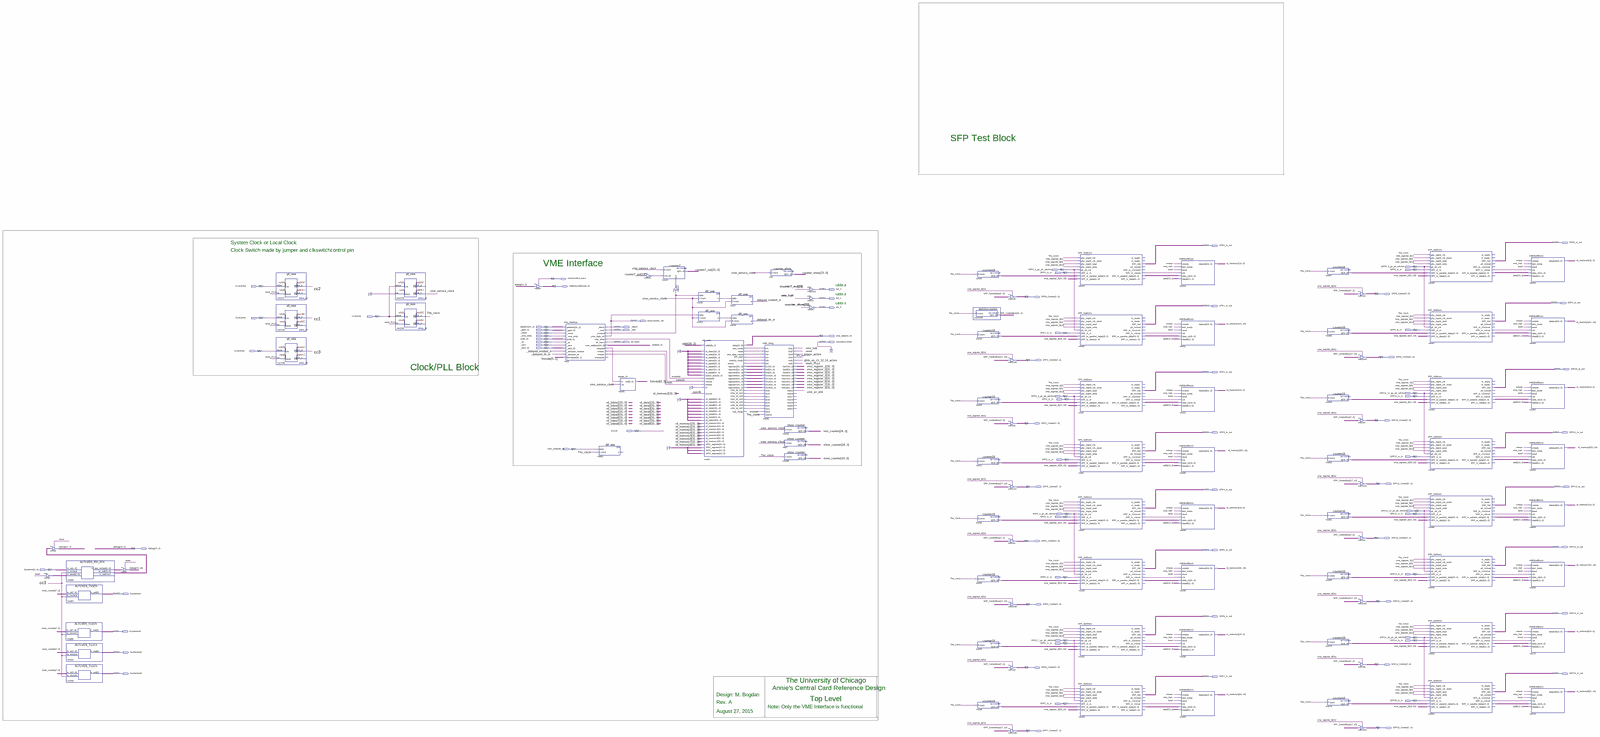
[diagram p0: schematic sheet, whole]
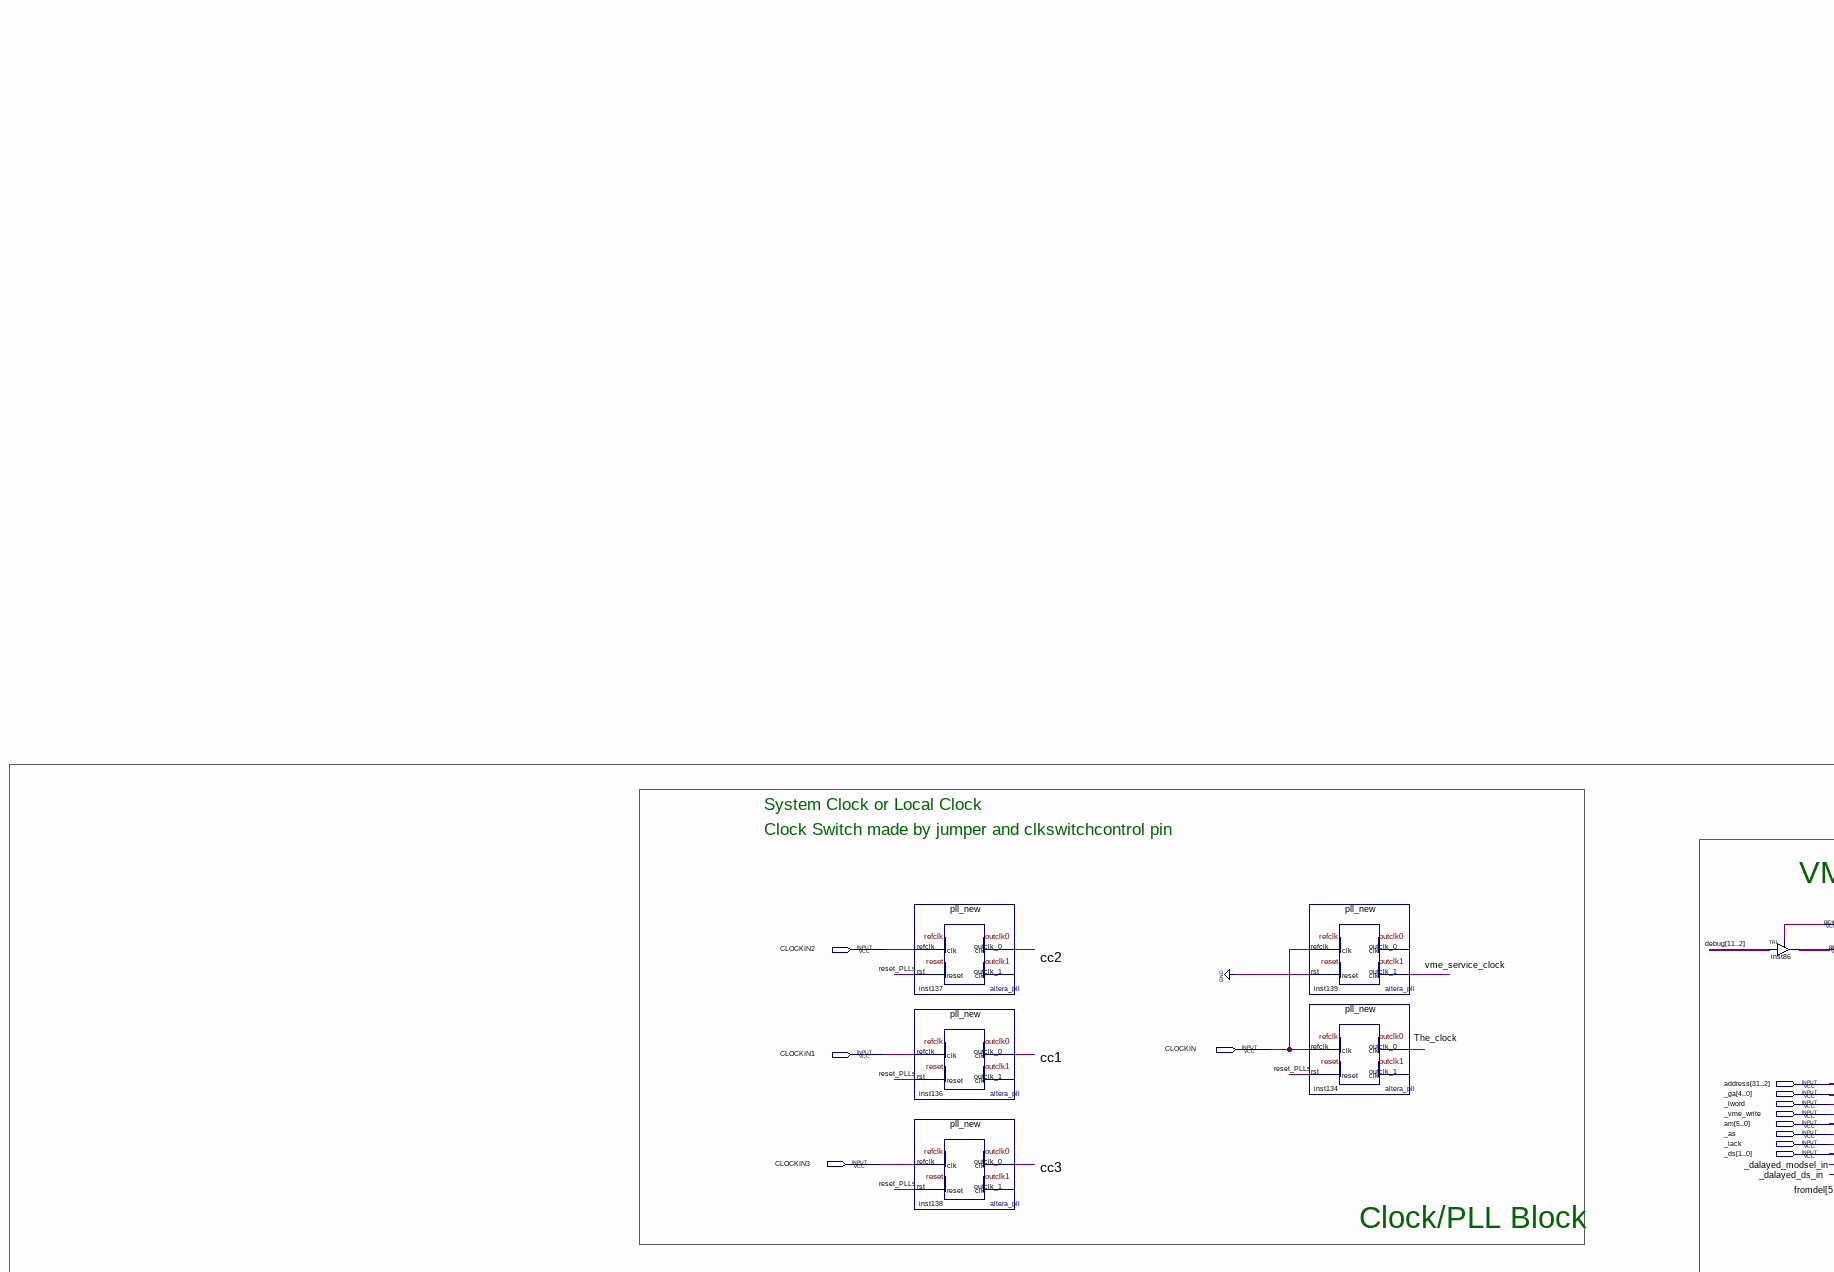
[diagram p1: schematic sheet, upper left part]
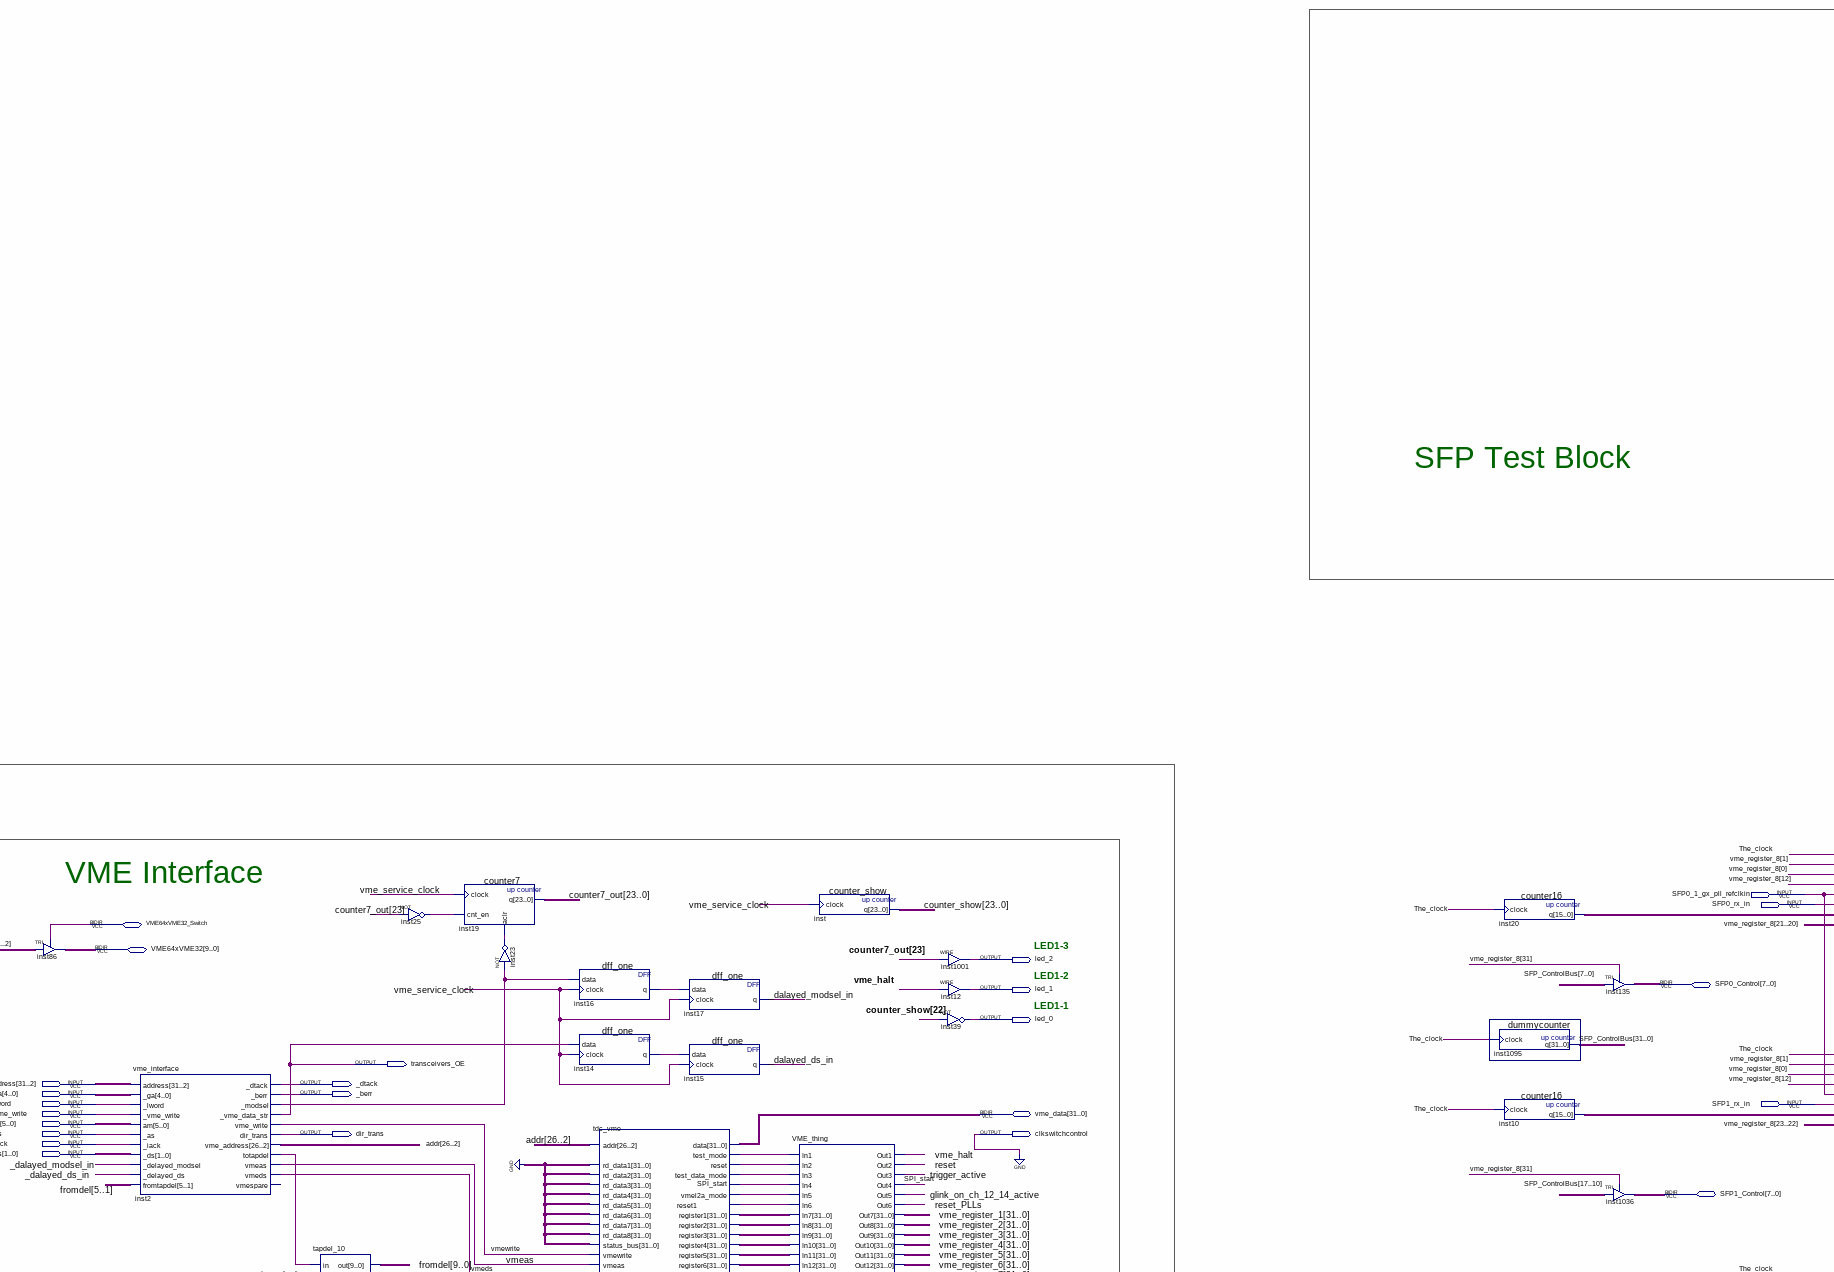
[diagram p2: schematic sheet, upper centre part]
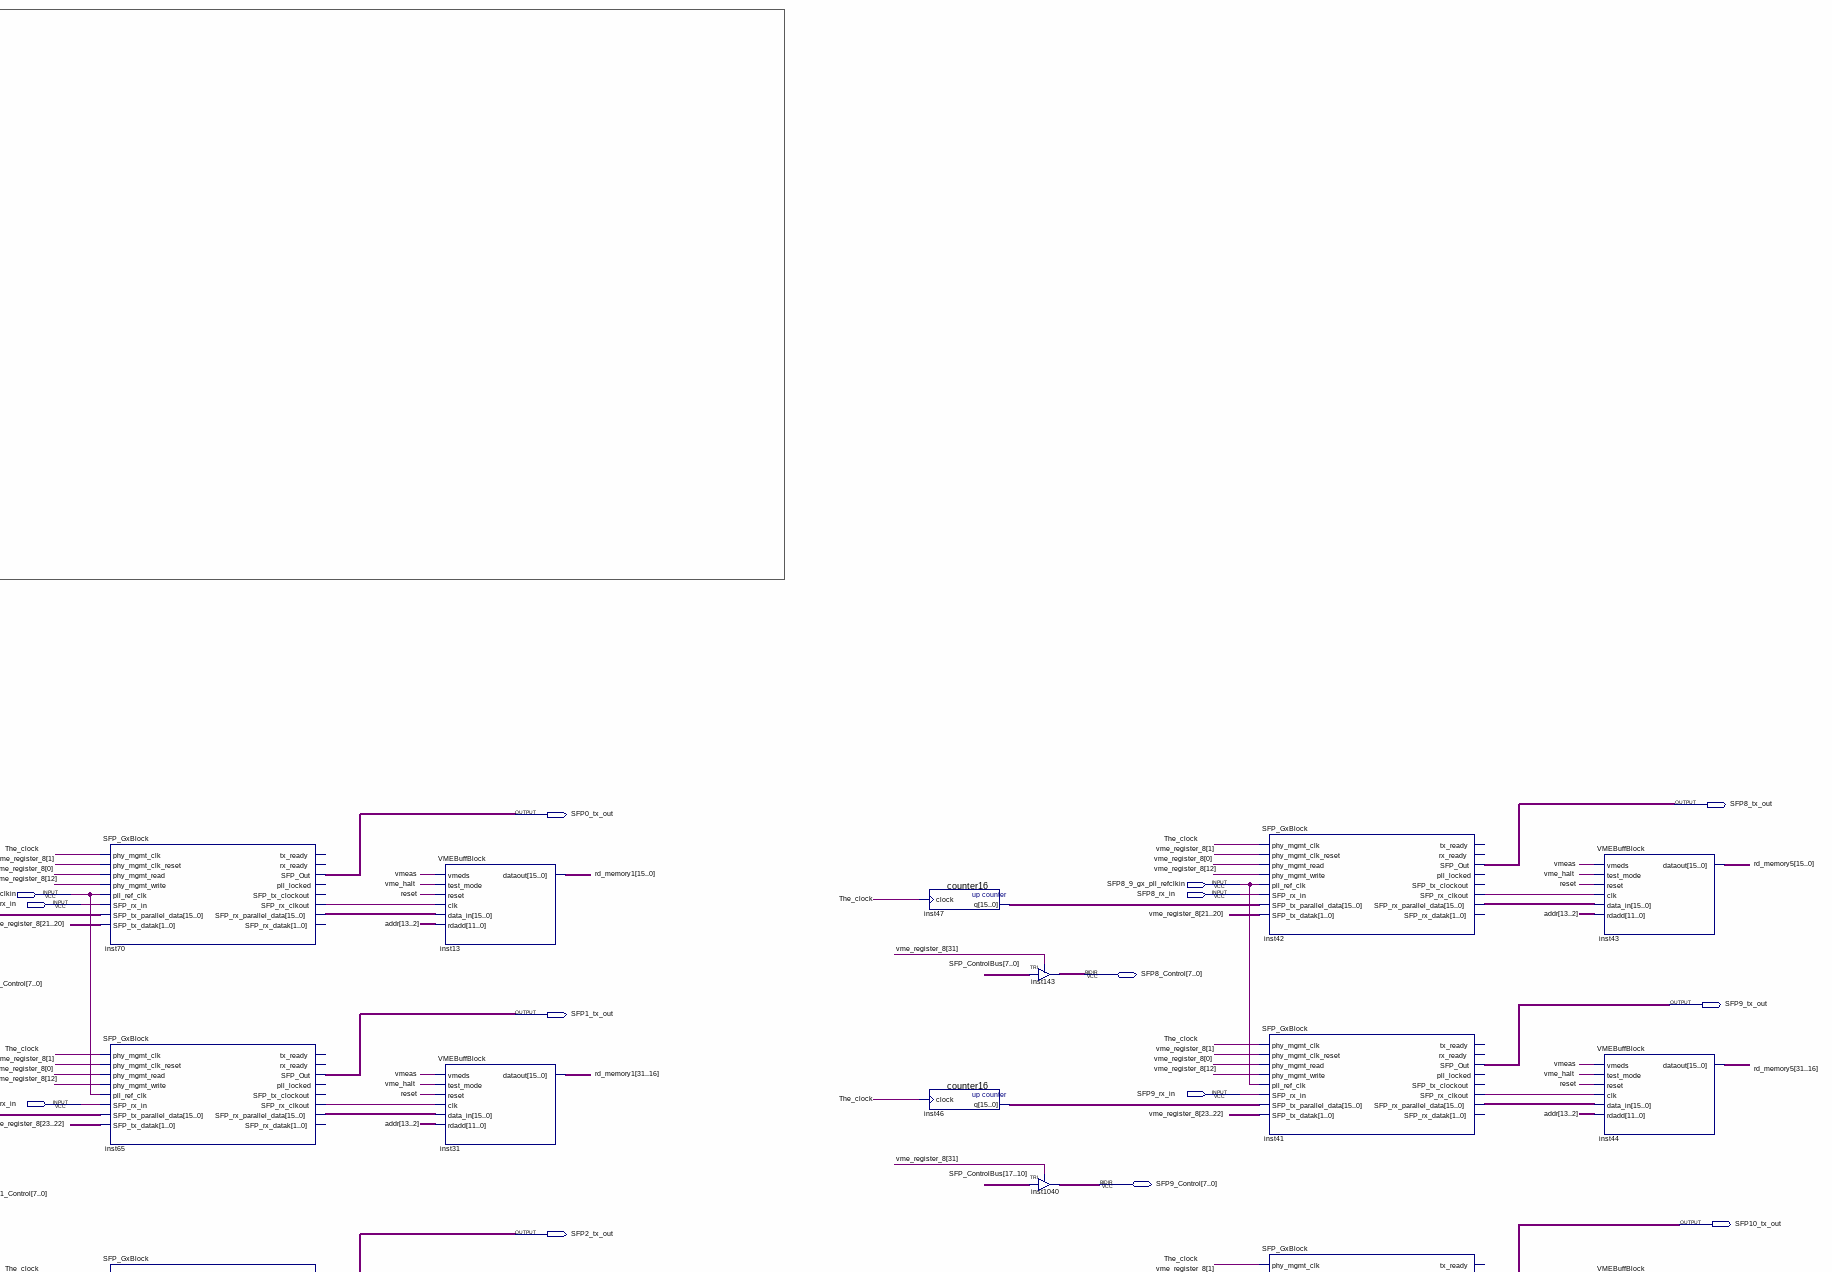
[diagram p3: schematic sheet, upper right part]
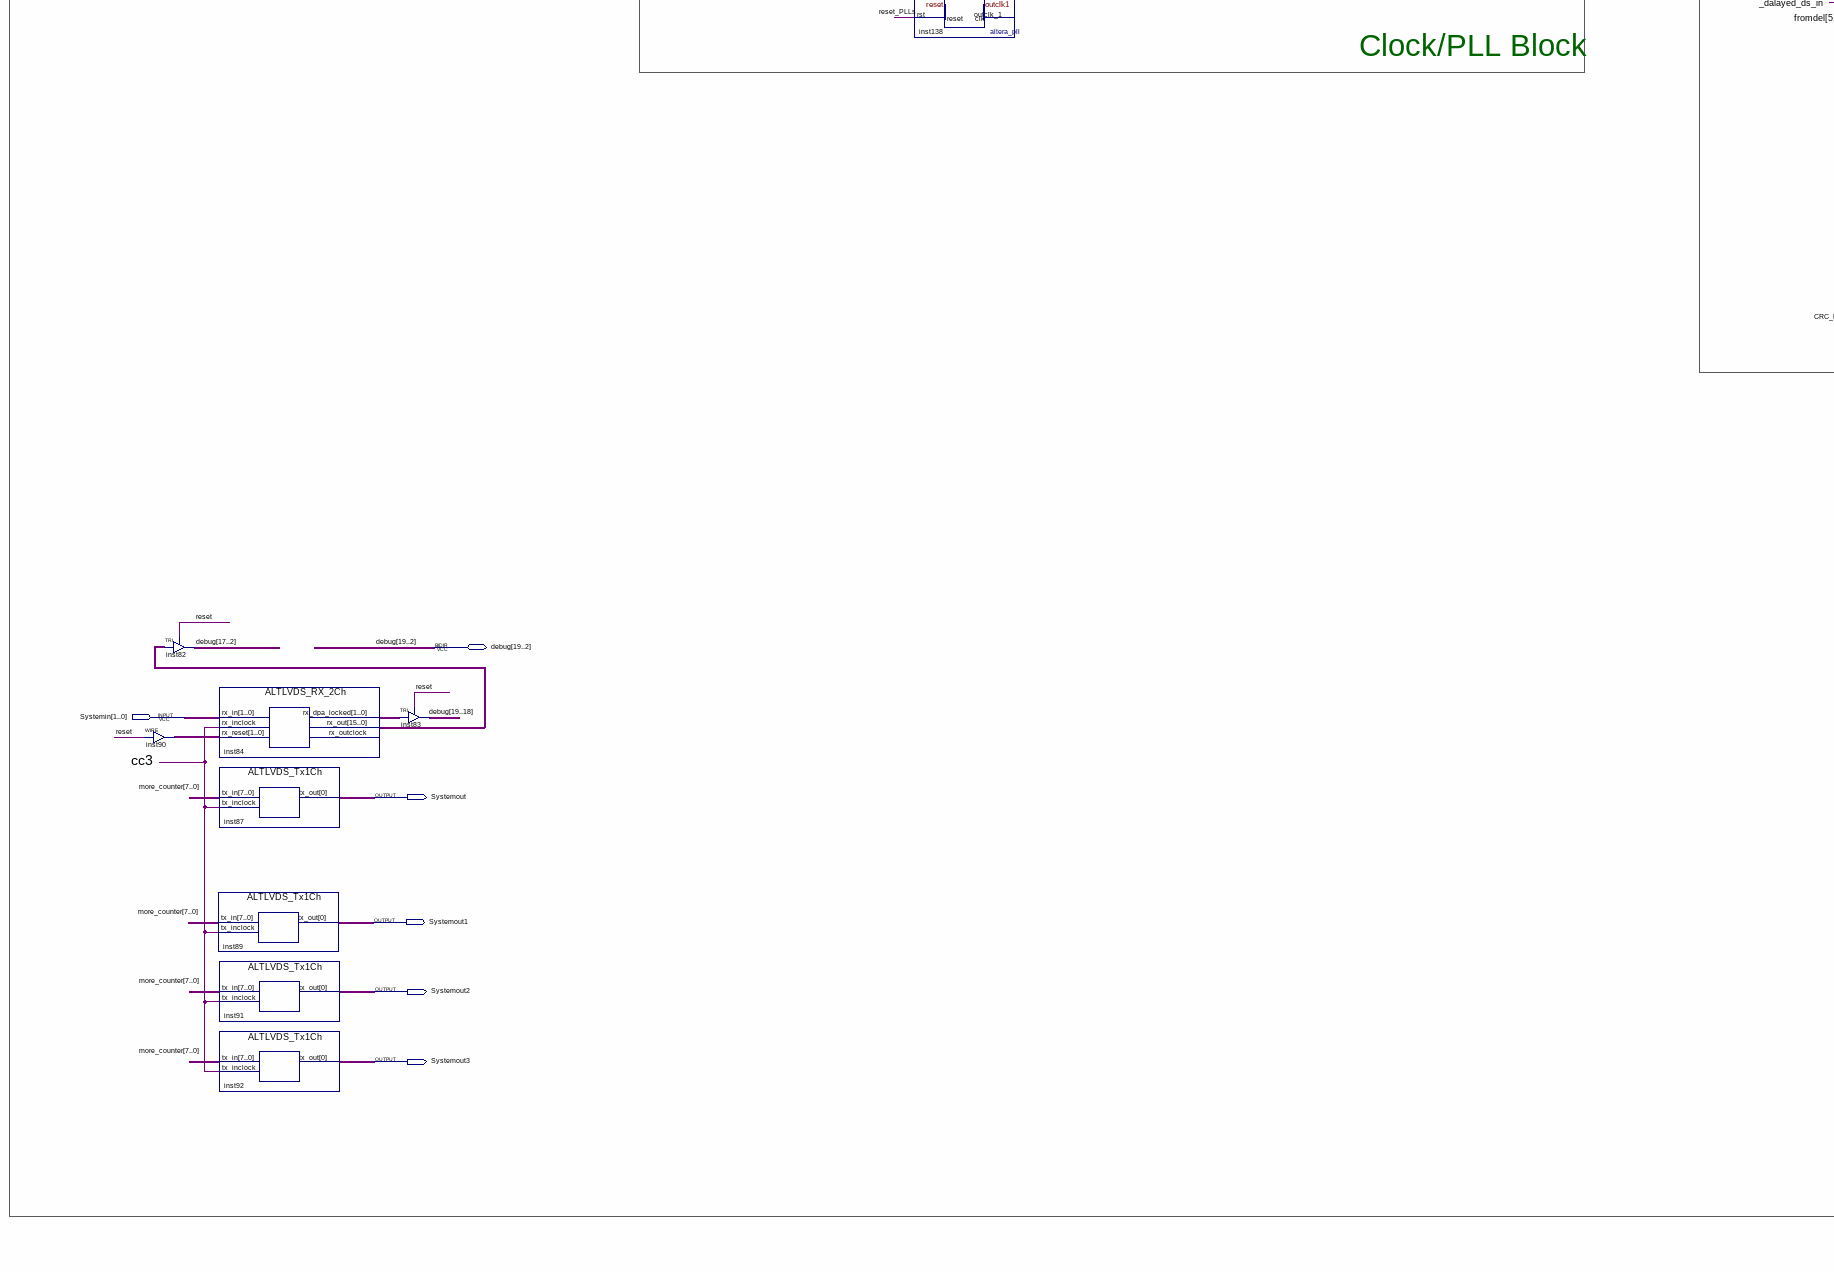
[diagram p4: schematic sheet, lower left part]
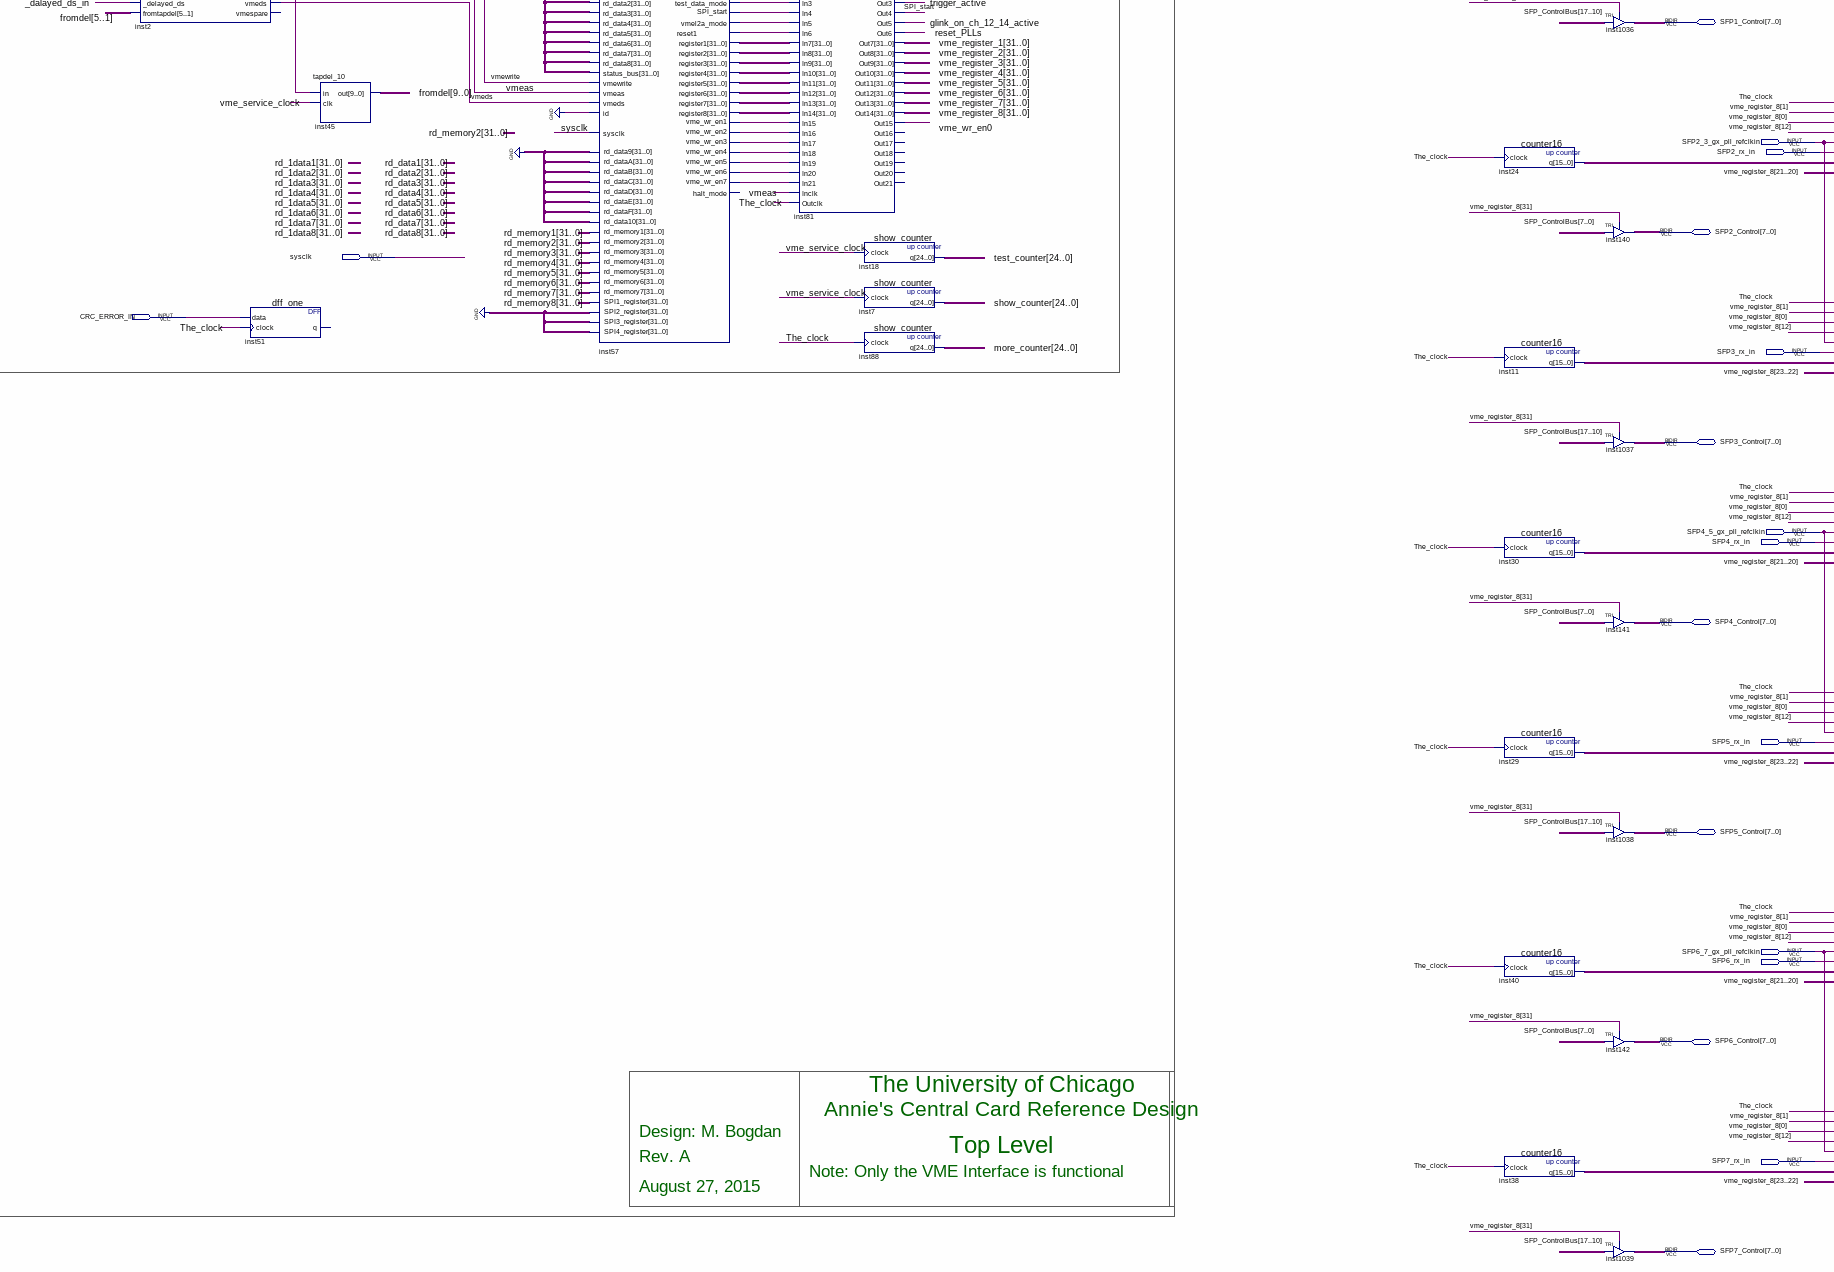
[diagram p5: schematic sheet, lower centre part]
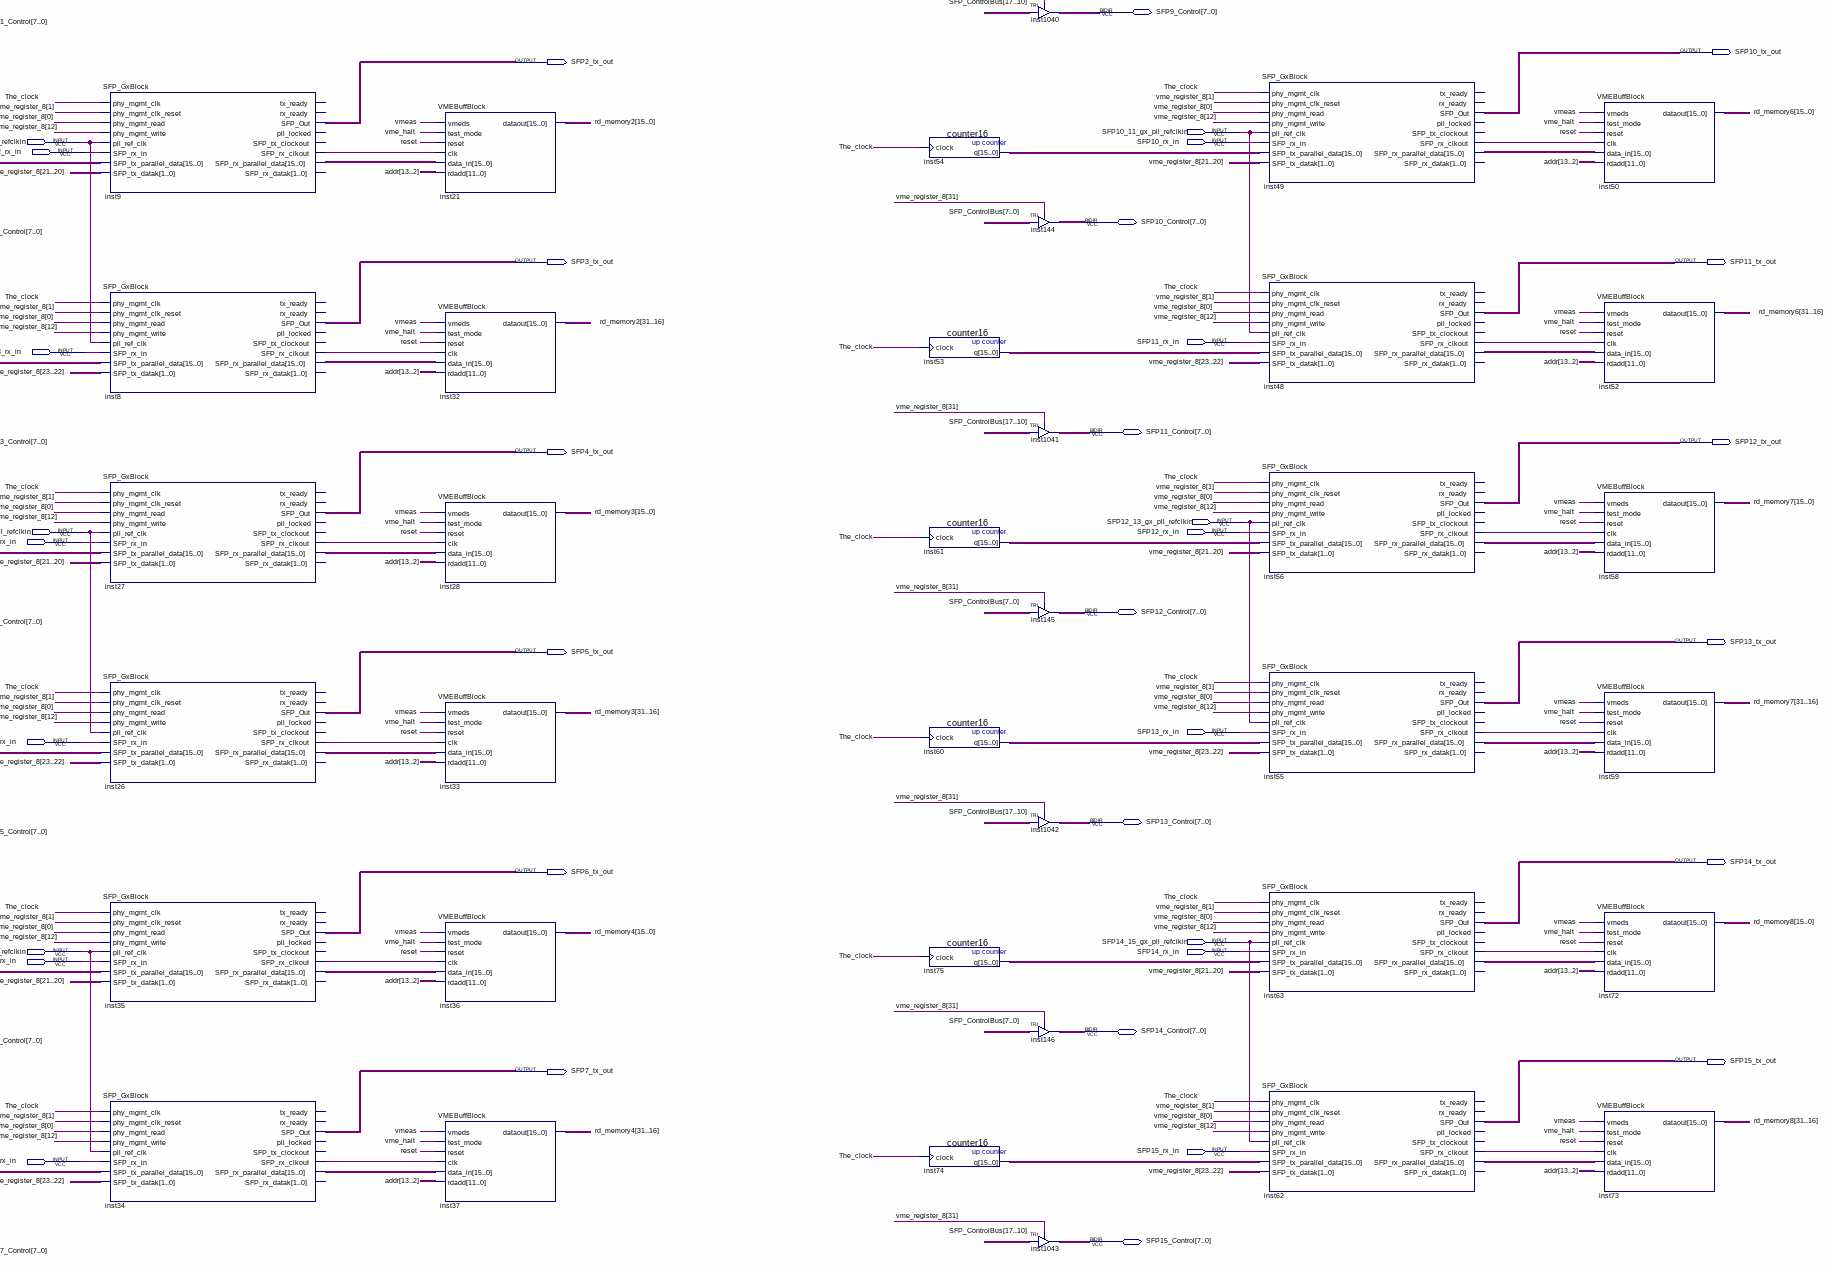
[diagram p6: schematic sheet, lower right part]
// Quartus schematic Rx_NoFit.bdf as structural Verilog: 98 symbols, 87 pins
module Rx_NoFit (
  input  SFP8_9_gx_pll_refclkin,
  input  SFP0_1_gx_pll_refclkin,
  input  SFP8_rx_in,
  input  SFP0_rx_in,
  input  CLOCKIN2,
  input  CLOCKIN,
  input  CLOCKIN1,
  input  [31:2] address,
  input  [4:0] _ga,
  input  SFP9_rx_in,
  input  _lword,
  input  SFP1_rx_in,
  input  _vme_write,
  input  [5:0] am,
  input  _as,
  input  _iack,
  input  [1:0] _ds,
  input  CLOCKIN3,
  input  SFP10_11_gx_pll_refclkin,
  input  SFP2_3_gx_pll_refclkin,
  input  SFP10_rx_in,
  input  SFP2_rx_in,
  input  sysclk,
  input  CRC_ERROR_IN,
  input  SFP11_rx_in,
  input  SFP3_rx_in,
  input  SFP12_13_gx_pll_refclkin,
  input  SFP4_5_gx_pll_refclkin,
  input  SFP12_rx_in,
  input  SFP4_rx_in,
  input  [1:0] Systemin,
  input  SFP13_rx_in,
  input  SFP5_rx_in,
  input  SFP14_15_gx_pll_refclkin,
  input  SFP6_7_gx_pll_refclkin,
  input  SFP14_rx_in,
  input  SFP6_rx_in,
  input  SFP15_rx_in,
  input  SFP7_rx_in,
  inout  VME64xVME32_Switch,
  inout  [9:0] VME64xVME32,
  inout  [7:0] SFP8_Control,
  inout  [7:0] SFP0_Control,
  inout  [31:0] vme_data,
  inout  [7:0] SFP9_Control,
  inout  [7:0] SFP1_Control,
  inout  [7:0] SFP10_Control,
  inout  [7:0] SFP2_Control,
  inout  [7:0] SFP11_Control,
  inout  [7:0] SFP3_Control,
  inout  [7:0] SFP12_Control,
  inout  [7:0] SFP4_Control,
  inout  [19:2] debug,
  inout  [7:0] SFP13_Control,
  inout  [7:0] SFP5_Control,
  inout  [7:0] SFP14_Control,
  inout  [7:0] SFP6_Control,
  inout  [7:0] SFP15_Control,
  inout  [7:0] SFP7_Control,
  output SFP8_tx_out,
  output SFP0_tx_out,
  output led_2,
  output led_1,
  output SFP9_tx_out,
  output SFP1_tx_out,
  output led_0,
  output transceivers_OE,
  output _dtack,
  output _berr,
  output dir_trans,
  output clkswitchcontrol,
  output SFP10_tx_out,
  output SFP2_tx_out,
  output SFP3_tx_out,
  output SFP11_tx_out,
  output SFP12_tx_out,
  output SFP4_tx_out,
  output SFP13_tx_out,
  output SFP5_tx_out,
  output Systemout,
  output SFP14_tx_out,
  output SFP6_tx_out,
  output Systemout1,
  output Systemout2,
  output Systemout3,
  output SFP15_tx_out,
  output SFP7_tx_out
);

  wire _dalayed_ds_in, _dalayed_modsel_in, cc1, cc2, cc3, glink_on_ch_12_14_active, inst2__modsel,
       inst2_totapdel, inst8_sfp_rx_clkout, inst9_sfp_rx_clkout, inst14_q, inst16_q, inst23_out, inst25_out,
       inst26_sfp_rx_clkout, inst27_sfp_rx_clkout, inst34_sfp_rx_clkout, inst35_sfp_rx_clkout,
       inst41_sfp_rx_clkout, inst42_sfp_rx_clkout, inst48_sfp_rx_clkout, inst49_sfp_rx_clkout,
       inst55_sfp_rx_clkout, inst56_sfp_rx_clkout, inst57_reset, inst57_reset1, inst57_spi_start,
       inst57_test_data_mode, inst57_test_mode, inst57_vme_wr_en1, inst57_vme_wr_en2, inst57_vme_wr_en3,
       inst57_vme_wr_en4, inst57_vme_wr_en5, inst57_vme_wr_en6, inst57_vme_wr_en7, inst57_vmel2a_mode,
       inst62_sfp_rx_clkout, inst63_sfp_rx_clkout, inst65_sfp_rx_clkout, inst70_sfp_rx_clkout, reset,
       reset_PLLs, SPI_start, The_clock, trigger_active, vme_halt, vme_service_clock, vme_wr_en0, vmeas,
       vmeds, vmewrite;
  wire [1:0] inst84_rx_dpa_locked, inst90_out;
  wire [9:0] fromdel;
  wire [15:0] inst8_sfp_rx_parallel_data, inst9_sfp_rx_parallel_data, inst10_q, inst11_q, inst20_q, inst24_q,
       inst26_sfp_rx_parallel_data, inst27_sfp_rx_parallel_data, inst29_q, inst30_q,
       inst34_sfp_rx_parallel_data, inst35_sfp_rx_parallel_data, inst38_q, inst40_q,
       inst41_sfp_rx_parallel_data, inst42_sfp_rx_parallel_data, inst46_q, inst47_q,
       inst48_sfp_rx_parallel_data, inst49_sfp_rx_parallel_data, inst53_q, inst54_q,
       inst55_sfp_rx_parallel_data, inst56_sfp_rx_parallel_data, inst60_q, inst61_q,
       inst62_sfp_rx_parallel_data, inst63_sfp_rx_parallel_data, inst65_sfp_rx_parallel_data,
       inst70_sfp_rx_parallel_data, inst74_q, inst75_q, inst84_rx_out;
  wire [23:0] counter7_out, counter_show;
  wire [24:0] more_counter, show_counter, test_counter;
  wire [26:2] addr;
  wire [31:0] inst57_register1, inst57_register2, inst57_register3, inst57_register4, inst57_register5,
       inst57_register6, inst57_register7, inst57_register8, rd_memory1, rd_memory2, rd_memory3, rd_memory4,
       rd_memory5, rd_memory6, rd_memory7, rd_memory8, SFP_ControlBus, vme_register_1, vme_register_2,
       vme_register_3, vme_register_4, vme_register_5, vme_register_6, vme_register_7, vme_register_8;

  TRI inst82[15:0] (.IN(inst84_rx_out), .OE(reset), .OUT(debug[17:2]));
  assign inst90_out = {2{reset}};  // WIRE inst90
  ALTLVDS_RX_2Ch inst84 (
    .rx_in(Systemin), .rx_inclock(cc3), .rx_reset(inst90_out), .rx_dpa_locked(inst84_rx_dpa_locked),
    .rx_out(inst84_rx_out));  // open: rx_outclock
  ALTLVDS_Tx1Ch inst87 (.tx_in(more_counter[7:0]), .tx_inclock(cc3), .tx_out(Systemout));
  ALTLVDS_Tx1Ch inst89 (.tx_in(more_counter[7:0]), .tx_inclock(cc3), .tx_out(Systemout1));
  ALTLVDS_Tx1Ch inst91 (.tx_in(more_counter[7:0]), .tx_inclock(cc3), .tx_out(Systemout2));
  ALTLVDS_Tx1Ch inst92 (.tx_in(more_counter[7:0]), .tx_inclock(cc3), .tx_out(Systemout3));
  TRI inst83[1:0] (.IN(inst84_rx_dpa_locked), .OE(reset), .OUT(debug[19:18]));
  pll_new inst137 (.refclk(CLOCKIN2), .rst(reset_PLLs), .outclk_0(cc2));  // open: outclk_1
  pll_new inst136 (.refclk(CLOCKIN1), .rst(reset_PLLs), .outclk_0(cc1));  // open: outclk_1
  pll_new inst138 (.refclk(CLOCKIN3), .rst(reset_PLLs), .outclk_0(cc3));  // open: outclk_1
  pll_new inst139 (.refclk(CLOCKIN), .rst(1'b0), .outclk_1(vme_service_clock));  // open: outclk_0
  pll_new inst134 (.refclk(CLOCKIN), .rst(reset_PLLs), .outclk_0(The_clock));  // open: outclk_1
  TRI inst86[9:0] (.IN(debug[11:2]), .OE(VME64xVME32_Switch), .OUT(VME64xVME32));
  vme_interface inst2 (
    .address(address), ._ga(_ga), ._lword(_lword), ._vme_write(_vme_write), .am(am), ._as(_as),
    ._iack(_iack), ._ds(_ds), ._delayed_modsel(_dalayed_modsel_in), ._delayed_ds(_dalayed_ds_in),
    .fromtapdel(fromdel[5:1]), ._modsel(inst2__modsel), ._vme_data_str(transceivers_OE),
    .vme_write(vmewrite), .dir_trans(dir_trans), .vme_address(addr), .totapdel(inst2_totapdel),
    .vmeas(vmeas), .vmeds(vmeds), ._dtack(_dtack), ._berr(_berr));  // open: vmespare
  dff_one inst51 (.data(CRC_ERROR_IN), .clock(The_clock));  // open: q
  tapdel_10 inst45 (.in(inst2_totapdel), .clk(vme_service_clock), .out(fromdel));
  not inst25 (inst25_out, counter7_out[23]);
  counter7 inst19 (.clock(vme_service_clock), .cnt_en(inst25_out), .aclr(inst23_out), .q(counter7_out));
  not inst23 (inst23_out, inst2__modsel);
  dff_one inst16 (.data(inst2__modsel), .clock(vme_service_clock), .q(inst16_q));
  dff_one inst14 (.data(transceivers_OE), .clock(vme_service_clock), .q(inst14_q));
  tdc_vme inst57 (
    .addr(addr), .rd_data1({32{1'b0}}), .rd_data2({32{1'b0}}), .rd_data3({32{1'b0}}), .rd_data4({32{1'b0}}),
    .rd_data5({32{1'b0}}), .rd_data6({32{1'b0}}), .rd_data7({32{1'b0}}), .rd_data8({32{1'b0}}),
    .status_bus({32{1'b0}}), .vmewrite(vmewrite), .vmeas(vmeas), .vmeds(vmeds), .id(1'b0), .sysclk(sysclk),
    .rd_dataA({32{1'b0}}), .rd_dataB({32{1'b0}}), .rd_dataC({32{1'b0}}), .rd_dataD({32{1'b0}}),
    .rd_dataF({32{1'b0}}), .rd_data10({32{1'b0}}), .rd_data9({32{1'b0}}), .rd_dataE({32{1'b0}}),
    .rd_memory1(rd_memory1), .rd_memory2(rd_memory2), .rd_memory3(rd_memory3), .rd_memory4(rd_memory4),
    .rd_memory5(rd_memory5), .rd_memory6(rd_memory6), .rd_memory7(rd_memory7), .SPI1_register(rd_memory8),
    .SPI2_register({32{1'b0}}), .SPI3_register({32{1'b0}}), .SPI4_register({32{1'b0}}),
    .test_mode(inst57_test_mode), .reset(inst57_reset), .test_data_mode(inst57_test_data_mode),
    .vmel2a_mode(inst57_vmel2a_mode), .register1(inst57_register1), .register2(inst57_register2),
    .register3(inst57_register3), .register4(inst57_register4), .register5(inst57_register5),
    .register6(inst57_register6), .register7(inst57_register7), .register8(inst57_register8),
    .reset1(inst57_reset1), .vme_wr_en1(inst57_vme_wr_en1), .vme_wr_en2(inst57_vme_wr_en2),
    .vme_wr_en3(inst57_vme_wr_en3), .vme_wr_en4(inst57_vme_wr_en4), .vme_wr_en5(inst57_vme_wr_en5),
    .vme_wr_en6(inst57_vme_wr_en6), .vme_wr_en7(inst57_vme_wr_en7), .SPI_start(inst57_spi_start),
    .data(vme_data));  // open: halt_mode
  dff_one inst17 (.data(inst16_q), .clock(vme_service_clock), .q(_dalayed_modsel_in));
  dff_one inst15 (.data(inst14_q), .clock(vme_service_clock), .q(_dalayed_ds_in));
  VME_thing inst81 (
    .In1(inst57_test_mode), .In2(inst57_reset), .In3(inst57_test_data_mode), .In4(inst57_spi_start),
    .In5(inst57_vmel2a_mode), .In6(inst57_reset1), .In7(inst57_register1), .In8(inst57_register2),
    .In9(inst57_register3), .In10(inst57_register4), .In11(inst57_register5), .In12(inst57_register6),
    .In13(inst57_register7), .In14(inst57_register8), .In15(inst57_vme_wr_en1), .In16(inst57_vme_wr_en2),
    .In17(inst57_vme_wr_en3), .In18(inst57_vme_wr_en4), .In19(inst57_vme_wr_en5), .In20(inst57_vme_wr_en6),
    .In21(inst57_vme_wr_en7), .Inclk(vmeas), .Outclk(The_clock), .Out1(vme_halt), .Out2(reset),
    .Out3(trigger_active), .Out4(SPI_start), .Out5(glink_on_ch_12_14_active), .Out6(reset_PLLs),
    .Out7(vme_register_1), .Out8(vme_register_2), .Out9(vme_register_3), .Out10(vme_register_4),
    .Out11(vme_register_5), .Out12(vme_register_6), .Out13(vme_register_7), .Out14(vme_register_8),
    .Out15(vme_wr_en0));  // open: Out16, Out17, Out18, Out19, Out20, Out21
  counter_show inst (.clock(vme_service_clock), .q(counter_show));
  show_counter inst18 (.clock(vme_service_clock), .q(test_counter));
  show_counter inst7 (.clock(vme_service_clock), .q(show_counter));
  show_counter inst88 (.clock(The_clock), .q(more_counter));
  assign led_2 = counter7_out[23];  // WIRE inst1001
  assign led_1 = vme_halt;  // WIRE inst12
  not inst39 (led_0, counter_show[22]);
  counter16 inst20 (.clock(The_clock), .q(inst20_q));
  dummycounter inst1095 (.clock(The_clock), .q(SFP_ControlBus));
  counter16 inst10 (.clock(The_clock), .q(inst10_q));
  counter16 inst24 (.clock(The_clock), .q(inst24_q));
  counter16 inst11 (.clock(The_clock), .q(inst11_q));
  counter16 inst30 (.clock(The_clock), .q(inst30_q));
  counter16 inst29 (.clock(The_clock), .q(inst29_q));
  counter16 inst40 (.clock(The_clock), .q(inst40_q));
  counter16 inst38 (.clock(The_clock), .q(inst38_q));
  TRI inst135[7:0] (.IN(SFP_ControlBus[7:0]), .OE(vme_register_8[31]), .OUT(SFP0_Control));
  TRI inst1036[7:0] (.IN(SFP_ControlBus[17:10]), .OE(vme_register_8[31]), .OUT(SFP1_Control));
  TRI inst140[7:0] (.IN(SFP_ControlBus[7:0]), .OE(vme_register_8[31]), .OUT(SFP2_Control));
  TRI inst1037[7:0] (.IN(SFP_ControlBus[17:10]), .OE(vme_register_8[31]), .OUT(SFP3_Control));
  TRI inst141[7:0] (.IN(SFP_ControlBus[7:0]), .OE(vme_register_8[31]), .OUT(SFP4_Control));
  TRI inst1038[7:0] (.IN(SFP_ControlBus[17:10]), .OE(vme_register_8[31]), .OUT(SFP5_Control));
  TRI inst142[7:0] (.IN(SFP_ControlBus[7:0]), .OE(vme_register_8[31]), .OUT(SFP6_Control));
  TRI inst1039[7:0] (.IN(SFP_ControlBus[17:10]), .OE(vme_register_8[31]), .OUT(SFP7_Control));
  SFP_GxBlock inst70 (
    .phy_mgmt_clk(The_clock), .phy_mgmt_clk_reset(vme_register_8[1]), .phy_mgmt_read(vme_register_8[0]),
    .phy_mgmt_write(vme_register_8[12]), .pll_ref_clk(SFP0_1_gx_pll_refclkin), .SFP_rx_in(SFP0_rx_in),
    .SFP_tx_parallel_data(inst20_q), .SFP_tx_datak(vme_register_8[21:20]), .SFP_Out(SFP0_tx_out),
    .SFP_rx_clkout(inst70_sfp_rx_clkout), .SFP_rx_parallel_data(inst70_sfp_rx_parallel_data));  // open: tx_ready, rx_ready, pll_locked, SFP_tx_clockout, SFP_rx_datak
  SFP_GxBlock inst65 (
    .phy_mgmt_clk(The_clock), .phy_mgmt_clk_reset(vme_register_8[1]), .phy_mgmt_read(vme_register_8[0]),
    .phy_mgmt_write(vme_register_8[12]), .pll_ref_clk(SFP0_1_gx_pll_refclkin), .SFP_rx_in(SFP1_rx_in),
    .SFP_tx_parallel_data(inst10_q), .SFP_tx_datak(vme_register_8[23:22]), .SFP_Out(SFP1_tx_out),
    .SFP_rx_clkout(inst65_sfp_rx_clkout), .SFP_rx_parallel_data(inst65_sfp_rx_parallel_data));  // open: tx_ready, rx_ready, pll_locked, SFP_tx_clockout, SFP_rx_datak
  SFP_GxBlock inst9 (
    .phy_mgmt_clk(The_clock), .phy_mgmt_clk_reset(vme_register_8[1]), .phy_mgmt_read(vme_register_8[0]),
    .phy_mgmt_write(vme_register_8[12]), .pll_ref_clk(SFP2_3_gx_pll_refclkin), .SFP_rx_in(SFP2_rx_in),
    .SFP_tx_parallel_data(inst24_q), .SFP_tx_datak(vme_register_8[21:20]), .SFP_Out(SFP2_tx_out),
    .SFP_rx_clkout(inst9_sfp_rx_clkout), .SFP_rx_parallel_data(inst9_sfp_rx_parallel_data));  // open: tx_ready, rx_ready, pll_locked, SFP_tx_clockout, SFP_rx_datak
  SFP_GxBlock inst8 (
    .phy_mgmt_clk(The_clock), .phy_mgmt_clk_reset(vme_register_8[1]), .phy_mgmt_read(vme_register_8[0]),
    .phy_mgmt_write(vme_register_8[12]), .pll_ref_clk(SFP2_3_gx_pll_refclkin), .SFP_rx_in(SFP3_rx_in),
    .SFP_tx_parallel_data(inst11_q), .SFP_tx_datak(vme_register_8[23:22]), .SFP_Out(SFP3_tx_out),
    .SFP_rx_clkout(inst8_sfp_rx_clkout), .SFP_rx_parallel_data(inst8_sfp_rx_parallel_data));  // open: tx_ready, rx_ready, pll_locked, SFP_tx_clockout, SFP_rx_datak
  SFP_GxBlock inst27 (
    .phy_mgmt_clk(The_clock), .phy_mgmt_clk_reset(vme_register_8[1]), .phy_mgmt_read(vme_register_8[0]),
    .phy_mgmt_write(vme_register_8[12]), .pll_ref_clk(SFP4_5_gx_pll_refclkin), .SFP_rx_in(SFP4_rx_in),
    .SFP_tx_parallel_data(inst30_q), .SFP_tx_datak(vme_register_8[21:20]), .SFP_Out(SFP4_tx_out),
    .SFP_rx_clkout(inst27_sfp_rx_clkout), .SFP_rx_parallel_data(inst27_sfp_rx_parallel_data));  // open: tx_ready, rx_ready, pll_locked, SFP_tx_clockout, SFP_rx_datak
  SFP_GxBlock inst26 (
    .phy_mgmt_clk(The_clock), .phy_mgmt_clk_reset(vme_register_8[1]), .phy_mgmt_read(vme_register_8[0]),
    .phy_mgmt_write(vme_register_8[12]), .pll_ref_clk(SFP4_5_gx_pll_refclkin), .SFP_rx_in(SFP5_rx_in),
    .SFP_tx_parallel_data(inst29_q), .SFP_tx_datak(vme_register_8[23:22]), .SFP_Out(SFP5_tx_out),
    .SFP_rx_clkout(inst26_sfp_rx_clkout), .SFP_rx_parallel_data(inst26_sfp_rx_parallel_data));  // open: tx_ready, rx_ready, pll_locked, SFP_tx_clockout, SFP_rx_datak
  SFP_GxBlock inst35 (
    .phy_mgmt_clk(The_clock), .phy_mgmt_clk_reset(vme_register_8[1]), .phy_mgmt_read(vme_register_8[0]),
    .phy_mgmt_write(vme_register_8[12]), .pll_ref_clk(SFP6_7_gx_pll_refclkin), .SFP_rx_in(SFP6_rx_in),
    .SFP_tx_parallel_data(inst40_q), .SFP_tx_datak(vme_register_8[21:20]), .SFP_Out(SFP6_tx_out),
    .SFP_rx_clkout(inst35_sfp_rx_clkout), .SFP_rx_parallel_data(inst35_sfp_rx_parallel_data));  // open: tx_ready, rx_ready, pll_locked, SFP_tx_clockout, SFP_rx_datak
  SFP_GxBlock inst34 (
    .phy_mgmt_clk(The_clock), .phy_mgmt_clk_reset(vme_register_8[1]), .phy_mgmt_read(vme_register_8[0]),
    .phy_mgmt_write(vme_register_8[12]), .pll_ref_clk(SFP6_7_gx_pll_refclkin), .SFP_rx_in(SFP7_rx_in),
    .SFP_tx_parallel_data(inst38_q), .SFP_tx_datak(vme_register_8[23:22]), .SFP_Out(SFP7_tx_out),
    .SFP_rx_clkout(inst34_sfp_rx_clkout), .SFP_rx_parallel_data(inst34_sfp_rx_parallel_data));  // open: tx_ready, rx_ready, pll_locked, SFP_tx_clockout, SFP_rx_datak
  VMEBuffBlock inst13 (
    .vmeds(vmeas), .test_mode(vme_halt), .reset(reset), .clk(inst70_sfp_rx_clkout), .rdadd(addr[13:2]),
    .data_in(inst70_sfp_rx_parallel_data), .dataout(rd_memory1[15:0]));
  VMEBuffBlock inst31 (
    .vmeds(vmeas), .test_mode(vme_halt), .reset(reset), .clk(inst65_sfp_rx_clkout), .rdadd(addr[13:2]),
    .data_in(inst65_sfp_rx_parallel_data), .dataout(rd_memory1[31:16]));
  VMEBuffBlock inst21 (
    .vmeds(vmeas), .test_mode(vme_halt), .reset(reset), .clk(inst9_sfp_rx_clkout), .rdadd(addr[13:2]),
    .data_in(inst9_sfp_rx_parallel_data), .dataout(rd_memory2[15:0]));
  VMEBuffBlock inst32 (
    .vmeds(vmeas), .test_mode(vme_halt), .reset(reset), .clk(inst8_sfp_rx_clkout), .rdadd(addr[13:2]),
    .data_in(inst8_sfp_rx_parallel_data), .dataout(rd_memory2[31:16]));
  VMEBuffBlock inst28 (
    .vmeds(vmeas), .test_mode(vme_halt), .reset(reset), .clk(inst27_sfp_rx_clkout), .rdadd(addr[13:2]),
    .data_in(inst27_sfp_rx_parallel_data), .dataout(rd_memory3[15:0]));
  VMEBuffBlock inst33 (
    .vmeds(vmeas), .test_mode(vme_halt), .reset(reset), .clk(inst26_sfp_rx_clkout), .rdadd(addr[13:2]),
    .data_in(inst26_sfp_rx_parallel_data), .dataout(rd_memory3[31:16]));
  VMEBuffBlock inst36 (
    .vmeds(vmeas), .test_mode(vme_halt), .reset(reset), .clk(inst35_sfp_rx_clkout), .rdadd(addr[13:2]),
    .data_in(inst35_sfp_rx_parallel_data), .dataout(rd_memory4[15:0]));
  VMEBuffBlock inst37 (
    .vmeds(vmeas), .test_mode(vme_halt), .reset(reset), .clk(inst34_sfp_rx_clkout), .rdadd(addr[13:2]),
    .data_in(inst34_sfp_rx_parallel_data), .dataout(rd_memory4[31:16]));
  counter16 inst47 (.clock(The_clock), .q(inst47_q));
  counter16 inst46 (.clock(The_clock), .q(inst46_q));
  counter16 inst54 (.clock(The_clock), .q(inst54_q));
  counter16 inst53 (.clock(The_clock), .q(inst53_q));
  counter16 inst61 (.clock(The_clock), .q(inst61_q));
  counter16 inst60 (.clock(The_clock), .q(inst60_q));
  counter16 inst75 (.clock(The_clock), .q(inst75_q));
  counter16 inst74 (.clock(The_clock), .q(inst74_q));
  TRI inst143[7:0] (.IN(SFP_ControlBus[7:0]), .OE(vme_register_8[31]), .OUT(SFP8_Control));
  TRI inst1040[7:0] (.IN(SFP_ControlBus[17:10]), .OE(vme_register_8[31]), .OUT(SFP9_Control));
  TRI inst144[7:0] (.IN(SFP_ControlBus[7:0]), .OE(vme_register_8[31]), .OUT(SFP10_Control));
  TRI inst1041[7:0] (.IN(SFP_ControlBus[17:10]), .OE(vme_register_8[31]), .OUT(SFP11_Control));
  TRI inst145[7:0] (.IN(SFP_ControlBus[7:0]), .OE(vme_register_8[31]), .OUT(SFP12_Control));
  TRI inst1042[7:0] (.IN(SFP_ControlBus[17:10]), .OE(vme_register_8[31]), .OUT(SFP13_Control));
  TRI inst146[7:0] (.IN(SFP_ControlBus[7:0]), .OE(vme_register_8[31]), .OUT(SFP14_Control));
  TRI inst1043[7:0] (.IN(SFP_ControlBus[17:10]), .OE(vme_register_8[31]), .OUT(SFP15_Control));
  SFP_GxBlock inst42 (
    .phy_mgmt_clk(The_clock), .phy_mgmt_clk_reset(vme_register_8[1]), .phy_mgmt_read(vme_register_8[0]),
    .phy_mgmt_write(vme_register_8[12]), .pll_ref_clk(SFP8_9_gx_pll_refclkin), .SFP_rx_in(SFP8_rx_in),
    .SFP_tx_parallel_data(inst47_q), .SFP_tx_datak(vme_register_8[21:20]), .SFP_Out(SFP8_tx_out),
    .SFP_rx_clkout(inst42_sfp_rx_clkout), .SFP_rx_parallel_data(inst42_sfp_rx_parallel_data));  // open: tx_ready, rx_ready, pll_locked, SFP_tx_clockout, SFP_rx_datak
  SFP_GxBlock inst41 (
    .phy_mgmt_clk(The_clock), .phy_mgmt_clk_reset(vme_register_8[1]), .phy_mgmt_read(vme_register_8[0]),
    .phy_mgmt_write(vme_register_8[12]), .pll_ref_clk(SFP8_9_gx_pll_refclkin), .SFP_rx_in(SFP9_rx_in),
    .SFP_tx_parallel_data(inst46_q), .SFP_tx_datak(vme_register_8[23:22]), .SFP_Out(SFP9_tx_out),
    .SFP_rx_clkout(inst41_sfp_rx_clkout), .SFP_rx_parallel_data(inst41_sfp_rx_parallel_data));  // open: tx_ready, rx_ready, pll_locked, SFP_tx_clockout, SFP_rx_datak
  SFP_GxBlock inst49 (
    .phy_mgmt_clk(The_clock), .phy_mgmt_clk_reset(vme_register_8[1]), .phy_mgmt_read(vme_register_8[0]),
    .phy_mgmt_write(vme_register_8[12]), .pll_ref_clk(SFP10_11_gx_pll_refclkin), .SFP_rx_in(SFP10_rx_in),
    .SFP_tx_parallel_data(inst54_q), .SFP_tx_datak(vme_register_8[21:20]), .SFP_Out(SFP10_tx_out),
    .SFP_rx_clkout(inst49_sfp_rx_clkout), .SFP_rx_parallel_data(inst49_sfp_rx_parallel_data));  // open: tx_ready, rx_ready, pll_locked, SFP_tx_clockout, SFP_rx_datak
  SFP_GxBlock inst48 (
    .phy_mgmt_clk(The_clock), .phy_mgmt_clk_reset(vme_register_8[1]), .phy_mgmt_read(vme_register_8[0]),
    .phy_mgmt_write(vme_register_8[12]), .pll_ref_clk(SFP10_11_gx_pll_refclkin), .SFP_rx_in(SFP11_rx_in),
    .SFP_tx_parallel_data(inst53_q), .SFP_tx_datak(vme_register_8[23:22]), .SFP_Out(SFP11_tx_out),
    .SFP_rx_clkout(inst48_sfp_rx_clkout), .SFP_rx_parallel_data(inst48_sfp_rx_parallel_data));  // open: tx_ready, rx_ready, pll_locked, SFP_tx_clockout, SFP_rx_datak
  SFP_GxBlock inst56 (
    .phy_mgmt_clk(The_clock), .phy_mgmt_clk_reset(vme_register_8[1]), .phy_mgmt_read(vme_register_8[0]),
    .phy_mgmt_write(vme_register_8[12]), .pll_ref_clk(SFP12_13_gx_pll_refclkin), .SFP_rx_in(SFP12_rx_in),
    .SFP_tx_parallel_data(inst61_q), .SFP_tx_datak(vme_register_8[21:20]), .SFP_Out(SFP12_tx_out),
    .SFP_rx_clkout(inst56_sfp_rx_clkout), .SFP_rx_parallel_data(inst56_sfp_rx_parallel_data));  // open: tx_ready, rx_ready, pll_locked, SFP_tx_clockout, SFP_rx_datak
  SFP_GxBlock inst55 (
    .phy_mgmt_clk(The_clock), .phy_mgmt_clk_reset(vme_register_8[1]), .phy_mgmt_read(vme_register_8[0]),
    .phy_mgmt_write(vme_register_8[12]), .pll_ref_clk(SFP12_13_gx_pll_refclkin), .SFP_rx_in(SFP13_rx_in),
    .SFP_tx_parallel_data(inst60_q), .SFP_tx_datak(vme_register_8[23:22]), .SFP_Out(SFP13_tx_out),
    .SFP_rx_clkout(inst55_sfp_rx_clkout), .SFP_rx_parallel_data(inst55_sfp_rx_parallel_data));  // open: tx_ready, rx_ready, pll_locked, SFP_tx_clockout, SFP_rx_datak
  SFP_GxBlock inst63 (
    .phy_mgmt_clk(The_clock), .phy_mgmt_clk_reset(vme_register_8[1]), .phy_mgmt_read(vme_register_8[0]),
    .phy_mgmt_write(vme_register_8[12]), .pll_ref_clk(SFP14_15_gx_pll_refclkin), .SFP_rx_in(SFP14_rx_in),
    .SFP_tx_parallel_data(inst75_q), .SFP_tx_datak(vme_register_8[21:20]), .SFP_Out(SFP14_tx_out),
    .SFP_rx_clkout(inst63_sfp_rx_clkout), .SFP_rx_parallel_data(inst63_sfp_rx_parallel_data));  // open: tx_ready, rx_ready, pll_locked, SFP_tx_clockout, SFP_rx_datak
  SFP_GxBlock inst62 (
    .phy_mgmt_clk(The_clock), .phy_mgmt_clk_reset(vme_register_8[1]), .phy_mgmt_read(vme_register_8[0]),
    .phy_mgmt_write(vme_register_8[12]), .pll_ref_clk(SFP14_15_gx_pll_refclkin), .SFP_rx_in(SFP15_rx_in),
    .SFP_tx_parallel_data(inst74_q), .SFP_tx_datak(vme_register_8[23:22]), .SFP_Out(SFP15_tx_out),
    .SFP_rx_clkout(inst62_sfp_rx_clkout), .SFP_rx_parallel_data(inst62_sfp_rx_parallel_data));  // open: tx_ready, rx_ready, pll_locked, SFP_tx_clockout, SFP_rx_datak
  VMEBuffBlock inst43 (
    .vmeds(vmeas), .test_mode(vme_halt), .reset(reset), .clk(inst42_sfp_rx_clkout), .rdadd(addr[13:2]),
    .data_in(inst42_sfp_rx_parallel_data), .dataout(rd_memory5[15:0]));
  VMEBuffBlock inst44 (
    .vmeds(vmeas), .test_mode(vme_halt), .reset(reset), .clk(inst41_sfp_rx_clkout), .rdadd(addr[13:2]),
    .data_in(inst41_sfp_rx_parallel_data), .dataout(rd_memory5[31:16]));
  VMEBuffBlock inst50 (
    .vmeds(vmeas), .test_mode(vme_halt), .reset(reset), .clk(inst49_sfp_rx_clkout), .rdadd(addr[13:2]),
    .data_in(inst49_sfp_rx_parallel_data), .dataout(rd_memory6[15:0]));
  VMEBuffBlock inst52 (
    .vmeds(vmeas), .test_mode(vme_halt), .reset(reset), .clk(inst48_sfp_rx_clkout), .rdadd(addr[13:2]),
    .data_in(inst48_sfp_rx_parallel_data), .dataout(rd_memory6[31:16]));
  VMEBuffBlock inst58 (
    .vmeds(vmeas), .test_mode(vme_halt), .reset(reset), .clk(inst56_sfp_rx_clkout), .rdadd(addr[13:2]),
    .data_in(inst56_sfp_rx_parallel_data), .dataout(rd_memory7[15:0]));
  VMEBuffBlock inst59 (
    .vmeds(vmeas), .test_mode(vme_halt), .reset(reset), .clk(inst55_sfp_rx_clkout), .rdadd(addr[13:2]),
    .data_in(inst55_sfp_rx_parallel_data), .dataout(rd_memory7[31:16]));
  VMEBuffBlock inst72 (
    .vmeds(vmeas), .test_mode(vme_halt), .reset(reset), .clk(inst63_sfp_rx_clkout), .rdadd(addr[13:2]),
    .data_in(inst63_sfp_rx_parallel_data), .dataout(rd_memory8[15:0]));
  VMEBuffBlock inst73 (
    .vmeds(vmeas), .test_mode(vme_halt), .reset(reset), .clk(inst62_sfp_rx_clkout), .rdadd(addr[13:2]),
    .data_in(inst62_sfp_rx_parallel_data), .dataout(rd_memory8[31:16]));

  assign clkswitchcontrol = 1'b0;

  // Notes on the sheet:
  //   SFP Test Block
  //   System Clock or Local Clock
  //   Clock Switch made by jumper and clkswitchcontrol pin
  //   VME Interface
  //   LED1-3
  //   LED1-2
  //   LED1-1
  //   Clock/PLL Block
  //   The University of Chicago
  //   Annie's Central Card Reference Design
  //   Design: M. Bogdan
  //   Top Level
  //   Rev. A
  //   Note: Only the VME Interface is functional
  //   August 27, 2015
endmodule
